# EAGLE design emp3032a (EAGLE 7.7.0)

## Sheet 1 of 2
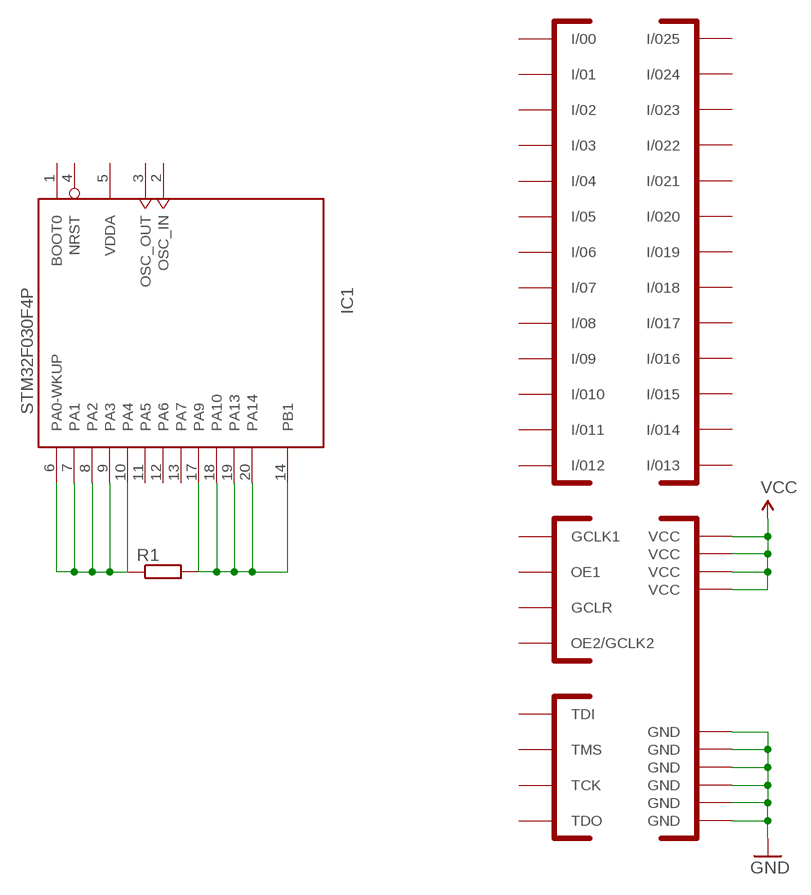
[diagram p0: schematic, sheet 1]

### Parts
IC1  STM32F030F4P  [TSSOP20-I]
R1  R1206  [R1206]
U$1  EPM3032  [TQFP44]

### Nets
GND: U$1.4(GND) U$1.11(GND) U$1.16(GND) U$1.24(GND) U$1.30(GND) U$1.36(GND) ; also sheet 2
N$1: IC1.6(PA0-WKUP) IC1.7(PA1) IC1.8(PA2) IC1.9(PA3) IC1.10(PA4) R1.1
N$2: IC1.14(PB1) IC1.17(PA9) IC1.18(PA10) IC1.19(PA13) IC1.20(PA14) R1.2
VCC: U$1.9(VCC) U$1.17(VCC) U$1.29(VCC) U$1.41(VCC)
Unconnected: IC1.1(BOOT0) IC1.2(OSC_IN) IC1.3(OSC_OUT) IC1.4(NRST) IC1.11(PA5) IC1.12(PA6) IC1.13(PA7)

## Sheet 2 of 2
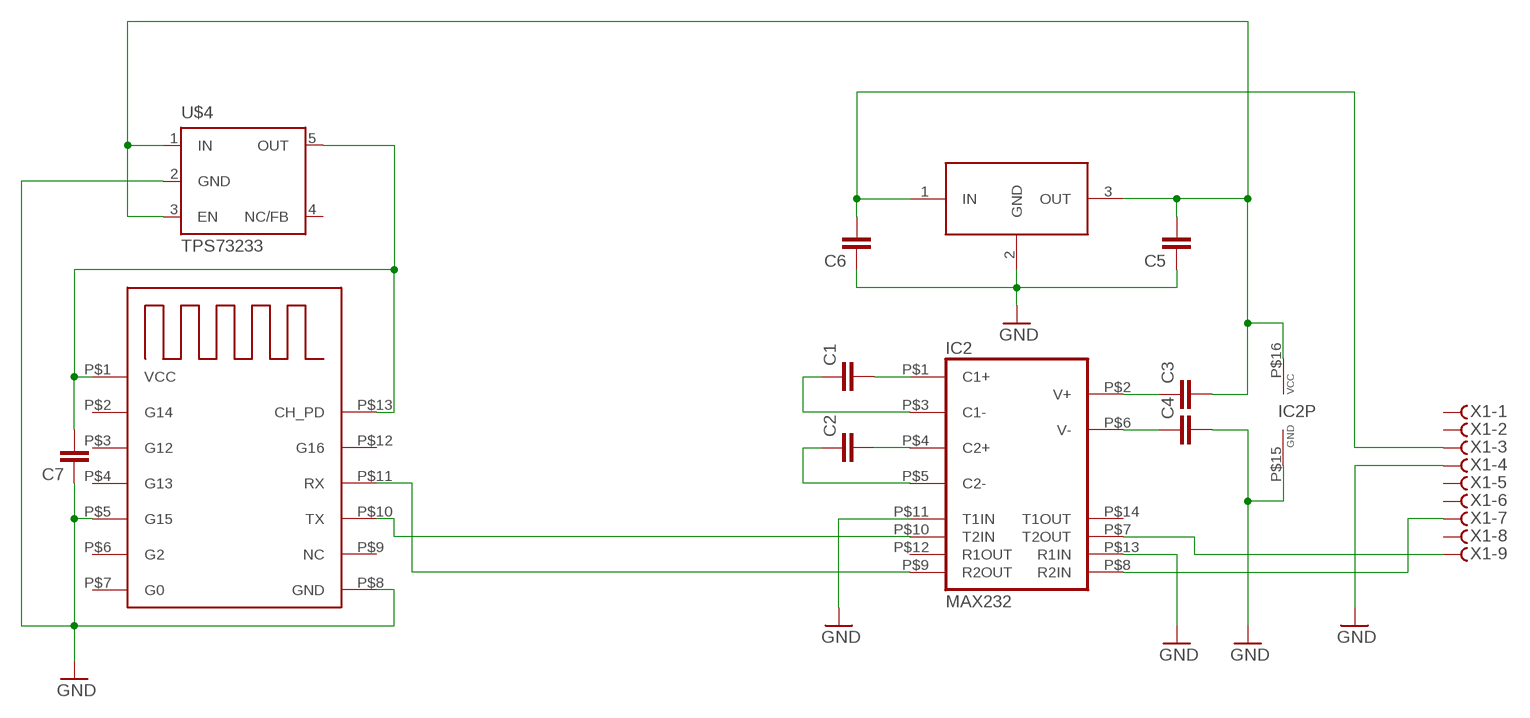
[diagram p1: schematic, sheet 2]

### Parts
C1  C-EUC1206K  [C1206K]
C2  C-EUC1206K  [C1206K]
C3  C-EUC1206K  [C1206K]
C4  C-EUC1206K  [C1206K]
C5  C-EUC1206K  [C1206K]
C6  C-EUC1206K  [C1206K]
C7  C-EUC1206K  [C1206K]
IC2  MAX232  [DIL16]
U$2  ESP03  [ESP03]
U$3  LM78M05BG  [DPACK]
U$4  TPS73233  [SOT23-DBV]
X1  F09HS  [F09H]

### Nets
GND: C4.2 C5.1 C6.1 C7.1 IC2.P$11(T1IN) IC2.P$13(R1IN) IC2.P$15(GND) U$2.P$5(G15) U$2.P$8(GND) U$3.2(GND) U$4.2(GND) X1.4 ; also sheet 1
N$3: C2.2 IC2.P$4(C2+)
N$4: C2.1 IC2.P$5(C2-)
N$5: C1.2 IC2.P$1(C1+)
N$6: C1.1 IC2.P$3(C1-)
N$7: C3.1 IC2.P$2(V+)
N$8: C4.1 IC2.P$6(V-)
N$9: IC2.P$9(R2OUT) U$2.P$11(RX)
N$10: IC2.P$7(T2OUT) X1.9
N$11: IC2.P$8(R2IN) X1.7
N$12: C6.2 U$3.1(IN) X1.3
N$13: IC2.P$10(T2IN) U$2.P$10(TX)
N$14: C7.2 U$2.P$1(VCC) U$2.P$13(CH_PD) U$4.5(OUT)
N$15: C3.2 C5.2 IC2.P$16(VCC) U$3.3(OUT) U$4.1(IN) U$4.3(EN)
Unconnected: IC2.P$12(R1OUT) IC2.P$14(T1OUT) U$2.P$2(G14) U$2.P$3(G12) U$2.P$4(G13) U$2.P$6(G2) U$2.P$7(G0) U$2.P$9(NC) U$2.P$12(G16) U$4.4(NC/FB) X1.1 X1.2 X1.5 X1.6 X1.8

## Power pins joined to a net without a drawn wire
GCLK1: U$1.37(GCLK1)
GCLR: U$1.39(GCLR)
I/00: U$1.2(I/00)
I/01: U$1.5(I/01)
I/02: U$1.6(I/02)
I/03: U$1.12(I/03)
I/04: U$1.13(I/04)
I/05: U$1.14(I/05)
I/06: U$1.15(I/06)
I/07: U$1.25(I/07)
I/08: U$1.44(I/08)
I/09: U$1.43(I/09)
I/010: U$1.42(I/010)
I/011: U$1.35(I/011)
I/012: U$1.34(I/012)
I/013: U$1.28(I/013)
I/014: U$1.27(I/014)
I/015: U$1.33(I/015)
I/016: U$1.21(I/016)
I/017: U$1.22(I/017)
I/018: U$1.23(I/018)
I/019: U$1.31(I/019)
I/020: U$1.18(I/020)
I/021: U$1.19(I/021)
I/022: U$1.8(I/022)
I/023: U$1.20(I/023)
I/024: U$1.10(I/024)
I/025: U$1.3(I/025)
OE1: U$1.38(OE1)
OE2/GCLK2: U$1.40(OE2/GCLK2)
TCK: U$1.26(TCK)
TDI: U$1.1(TDI)
TDO: U$1.32(TDO)
TMS: U$1.7(TMS)
VDD: IC1.16(VDD)
VDDA: IC1.5(VDDA)
VSS: IC1.15(VSS)

## Library data of the parts
C1-C7 = rcl:C-EU: CAPACITOR, European symbol
IC1 = micro-stm_v3:STM32F030F*P: ARM 32-bit Cortex™-M0 CPU 48 MHz maximum frequency 16 Kbytes of Flash memory 4 kbytes of SRAM 15 GPIOs 2.4 to 3.6 V application supply
IC2 = connectors:MAX232: RS232 TRANSEIVER
R1 = smalsmd:R
U$1 = EPM3032:EPM3032
U$2 = connectors:ESP03
U$3 = stabil:LM78M05BG
U$4 = stabil:TPS73233
X1 = con-subd:F09?S: SUB-D

## Board
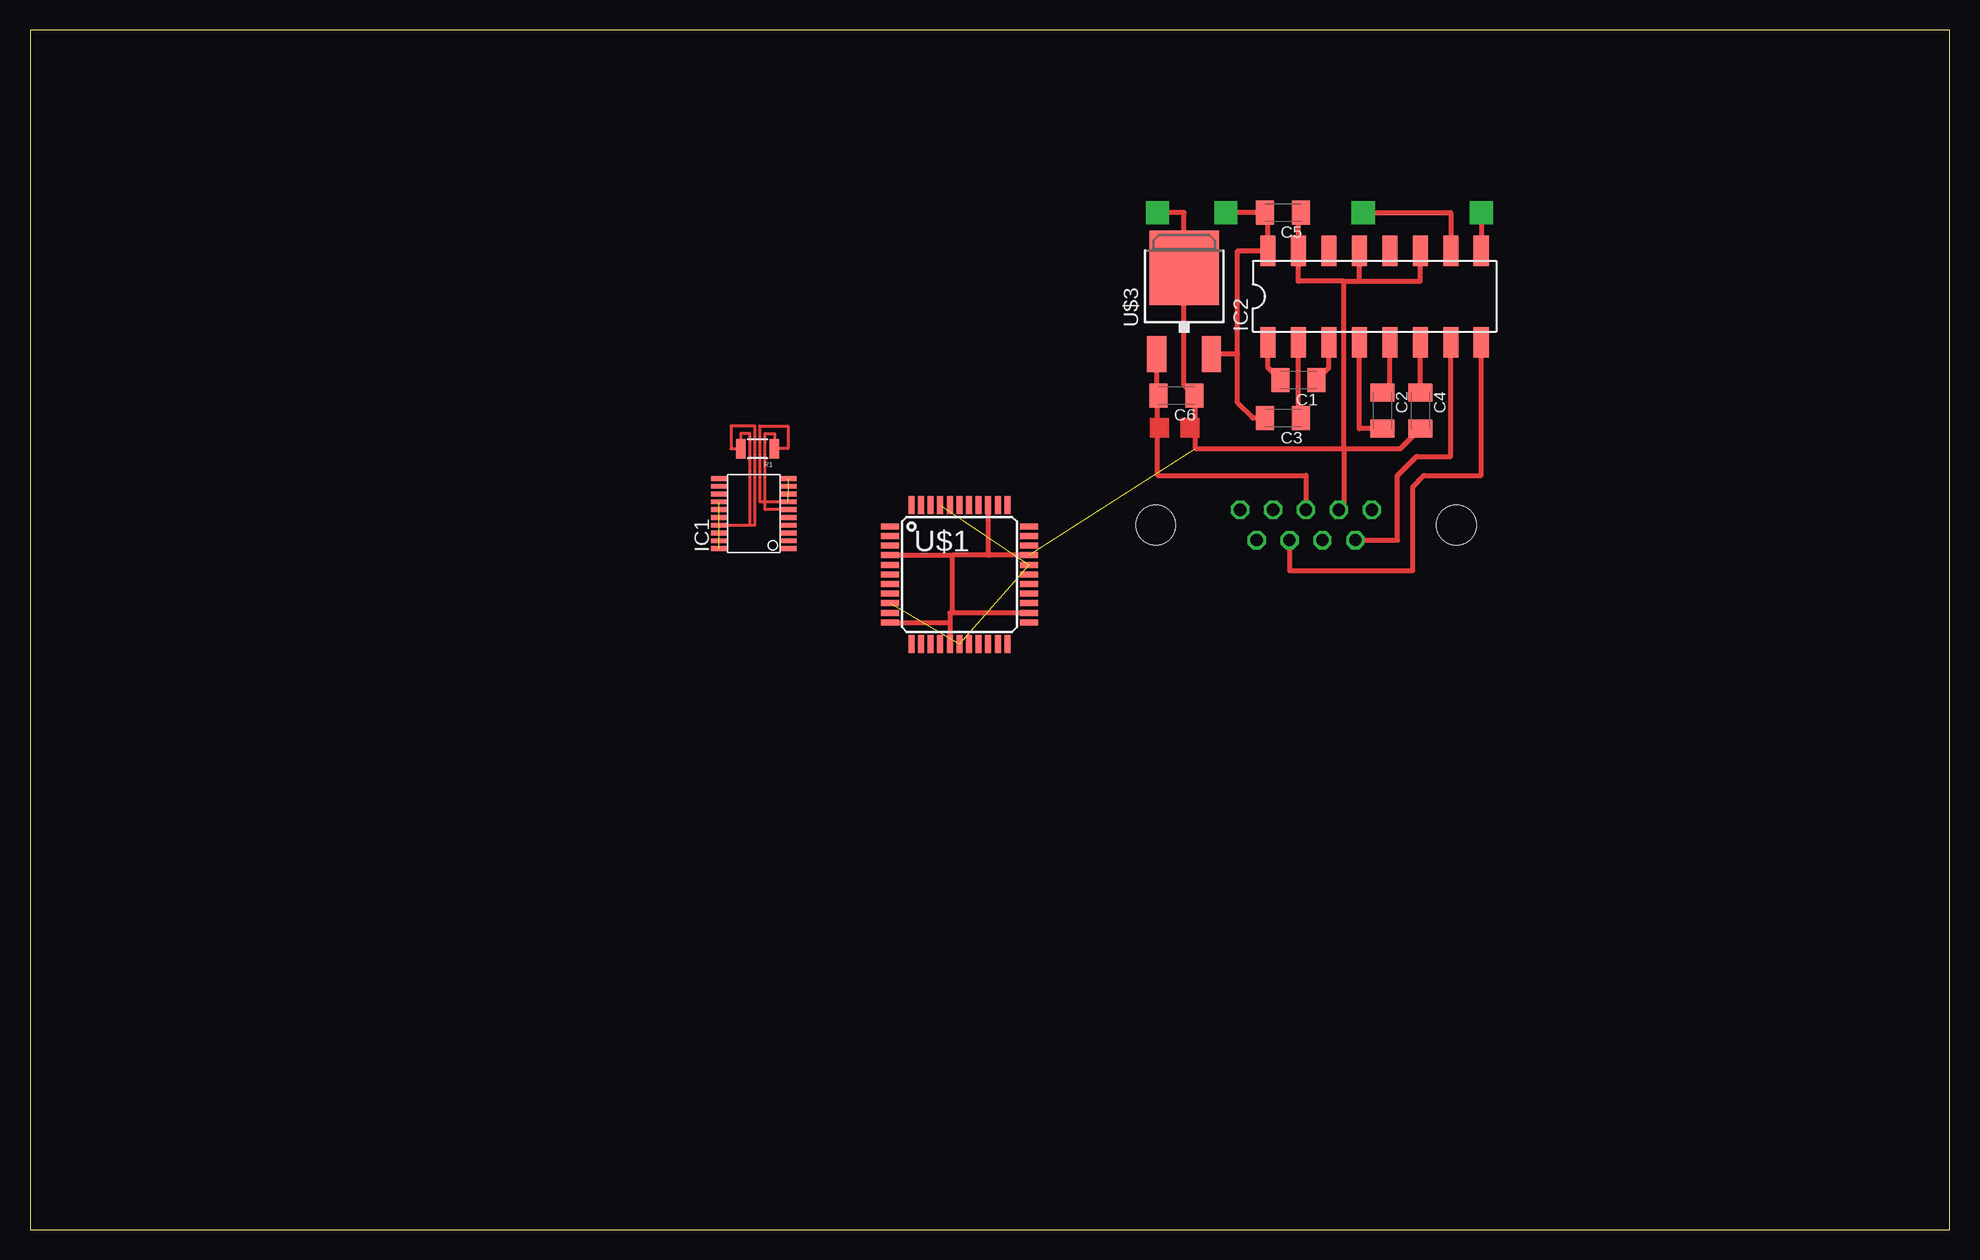
[diagram p2: board, top side]
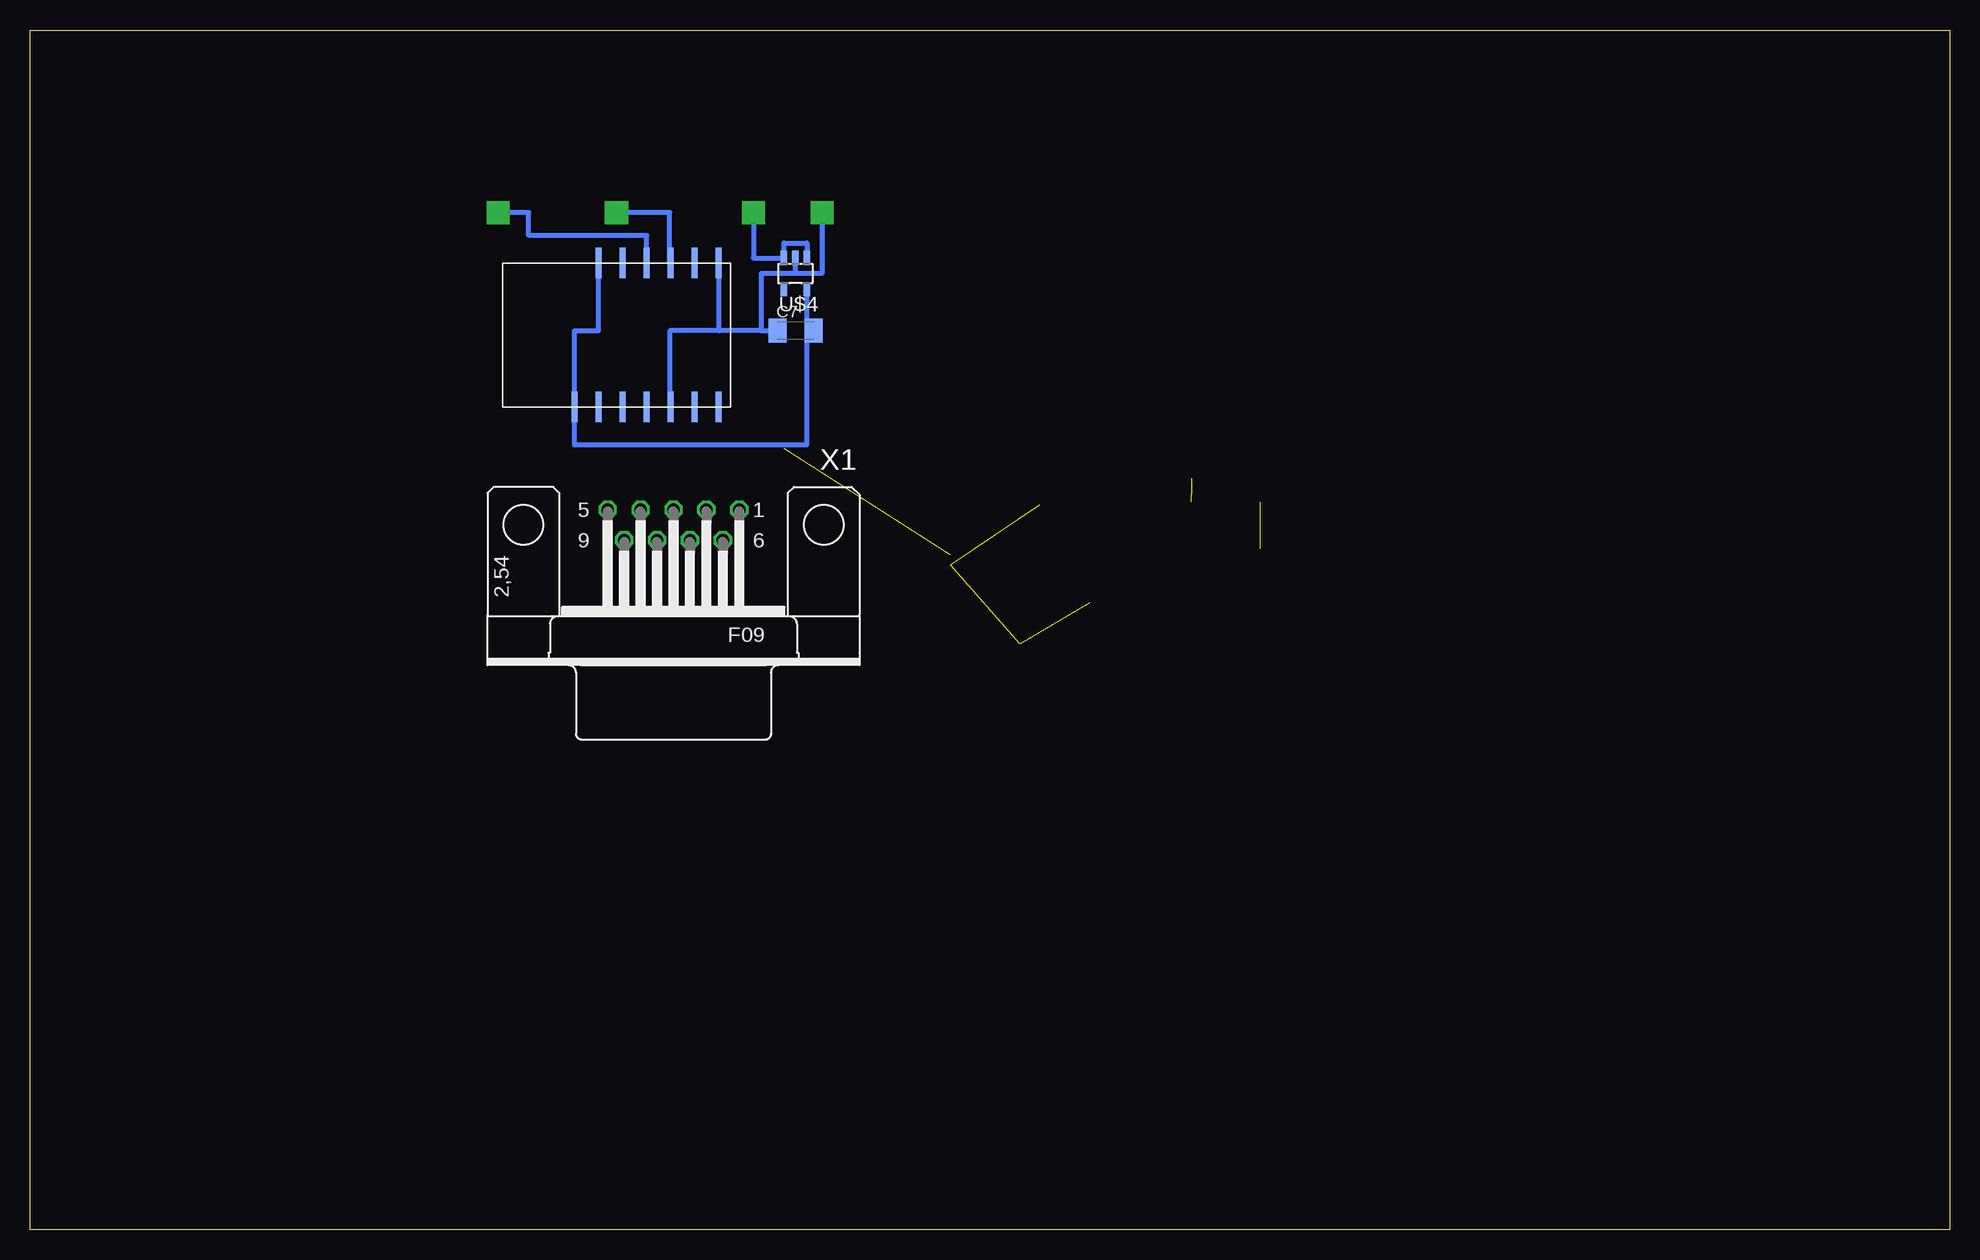
[diagram p3: board, bottom side, seen from below]

Size 160 x 100 mm. Coordinates in mm from the lower left corner, seen from the top.
Outline: 0,0 160,0 160,100 0,100 0,0
Copper layers (1*16): Top 0.035mm / dielectric 1.5mm / Bottom 0.035mm
Design rules "default": minimum track width 10mil, minimum drill 24mil, track to track 8mil, track to pad 8mil, pad to pad 8mil, via to via 8mil, smd to smd 8mil, copper to edge 40mil, drill to drill 8mil, minimum pad ring 10mil, minimum via ring 8mil, stop-mask expansion 4mil, vias tented up to drill 0mil, thermal gap 10mil

### Footprints (pad centres in the part's own frame; a part is rotated, then mirrored left to right if it is on the bottom)
C1206K = smd 1.5 x 2: 1 -1.5,0; 2 1.5,0
TSSOP20-I = smd 0.4 x 1.35: 1 -2.925,-2.875; 2 -2.275,-2.875; 3 -1.625,-2.875; 4 -0.975,-2.875; 5 -0.325,-2.875; 6 0.325,-2.875; 7 0.975,-2.875; 8 1.625,-2.875; 9 2.275,-2.875; 10 2.925,-2.875; 11 2.925,2.875; 12 2.275,2.875; 13 1.625,2.875; 14 0.975,2.875; 15 0.325,2.875; 16 -0.325,2.875; 17 -0.975,2.875; 18 -1.625,2.875; 19 -2.275,2.875; 20 -2.925,2.875
DIL16 = smd 1.27 x 2.54: P$1 -8.89,-3.81; P$2 -6.35,-3.81; P$3 -3.81,-3.81; P$4 -1.27,-3.81; P$5 1.27,-3.81; P$6 3.81,-3.81; P$7 6.35,-3.81; P$8 8.89,-3.81; P$9 8.89,3.81; P$10 6.35,3.81; P$11 3.81,3.81; P$12 1.27,3.81; P$13 -1.27,3.81; P$14 -3.81,3.81; P$15 -6.35,3.81; P$16 -8.89,3.81
R1206 = smd 0.8 x 1.6: 1 -1.4,0; 2 1.4,0
TQFP44 = smd 1.5 x 0.5: 1 -5.8,4; 2 -5.8,3.2; 3 -5.8,2.4; 4 -5.8,1.6; 5 -5.8,0.8; 6 -5.8,0; 7 -5.8,-0.8; 8 -5.8,-1.6; 9 -5.8,-2.4; 10 -5.8,-3.2; 11 -5.8,-4; 23 5.8,-4; 24 5.8,-3.2; 25 5.8,-2.4; 26 5.8,-1.6; 27 5.8,-0.8; 28 5.8,0; 29 5.8,0.8; 30 5.8,1.6; 31 5.8,2.4; 32 5.8,3.2; 33 5.8,4 | smd 0.5 x 1.5: 12 -4,-5.8; 13 -3.2,-5.8; 14 -2.4,-5.8; 15 -1.6,-5.8; 16 -0.8,-5.8; 17 0,-5.8; 18 0.8,-5.8; 19 1.6,-5.8; 20 2.4,-5.8; 21 3.2,-5.8; 22 4,-5.8; 34 4,5.8; 35 3.2,5.8; 36 2.4,5.8; 37 1.6,5.8; 38 0.8,5.8; 39 0,5.8; 40 -0.8,5.8; 41 -1.6,5.8; 42 -2.4,5.8; 43 -3.2,5.8; 44 -4,5.8
ESP03 = smd 2.54 x 0.5: P$1 0,0; P$2 0,-2; P$3 0,-4; P$4 0,-6; P$5 0,-8; P$6 0,-10; P$7 0,-12; P$8 12,-12; P$9 12,-10; P$10 12,-8; P$11 12,-6; P$12 12,-4; P$13 12,-2
DPACK = smd 1.6 x 3: 1 -2.28,-4.8; 3 2.28,-4.8 | smd 5.8 x 6.2: 2 0,2.38
SOT23-DBV = smd 0.55 x 1.2: 1 -0.95,-1.3; 2 0,-1.3; 3 0.95,-1.3; 4 0.95,1.3; 5 -0.95,1.3
F09H = drill 1.016 octagon: 1 -5.486,-1.27; 2 -2.743,-1.27; 3 0,-1.27; 4 2.743,-1.27; 5 5.486,-1.27; 6 -4.115,1.27; 7 -1.372,1.27; 8 1.372,1.27; 9 4.115,1.27 | hole 3.302: -12.522,0; 12.522,0

### Placement (x,y rotation side)
C1  105.73,70.8 180 top
C2  112.71,68.26 270 top
C3  104.46,67.63 180 top
C4  115.89,68.26 270 top
C5  104.46,84.77 180 top
C6  95.57,69.53 180 top
C7  96.2,74.93 0 bottom
IC1  60.33,59.69 90 top
IC2  112.08,77.79 0 top
R1  60.64,65.09 180 top
U$1  77.47,54.61 0 top
U$2  114.62,68.58 90 bottom
U$3  96.2,77.79 0 top
U$4  96.2,79.69 180 bottom
X1  106.36,58.74 180 bottom

### Tracks (layer width: path | path; a pad name or v marks a point on that pad's centre or on a via)
GND  (via drill 0 pad 1.93)  (1 unrouted)
  Top 0.406: U$1.11 76.67,50.61 | 76.67,50.61 U$1.16 | U$1.24 76.83,51.41 | 76.83,51.41 76.67,51.41 76.67,50.61 | U$1.30 80.01,56.21 79.87,56.21 | 79.87,56.21 76.83,56.21 | 76.83,56.21 76.83,51.41 | U$1.4 76.83,56.21 | U$1.36 79.87,56.21 | 115.89,66.99 C4.2 114.21,65.09 109.54,65.09 | 110.81,79.06 IC2.P$13 | 110.81,79.06 115.89,79.06 IC2.P$11 | 109.54,79.06 105.73,79.06 IC2.P$15 105.73,84.77 C5.1 | 109.54,79.06 110.81,79.06 | U$3.2 96.84,80.17 | U$3.2 96.2,70.4 C6.1 97.16,69.44 97.16,65.09 109.54,65.09 | X1.4 109.54,60.01 109.54,65.09 | 109.54,65.09 109.54,79.06 | v93.98,84.77 96.2,84.77 U$3.2
  Bottom 0.406: 96.2,79.69 99.06,79.69 99.06,74.93 | 96.2,79.69 U$4.2 | 99.06,74.93 C7.1 | U$2.P$5 106.68,68.58 106.68,74.93 102.55,74.93 | U$2.P$8 102.55,80.58 102.55,74.93 | 96.2,79.69 93.98,79.69 v93.98,84.77 | 99.06,74.93 102.55,74.93
N$1  (3 unrouted)
  Top 0.254: IC1.6 61.28,60.02 61.28,66.36 62.04,66.36 R1.1 63.18,65.09 63.18,66.99 60.84,66.99 60.84,60.66 IC1.7
N$2  (4 unrouted)
  Top 0.254: R1.2 59.24,66.36 60.01,66.36 60.01,58.72 IC1.17 60.42,58.72 60.42,66.99 58.42,66.99 58.42,65.09 59.37,65.09
N$3
  Top 0.406: 110.58,73.98 IC2.P$4 110.81,66.76 C2.2
N$4
  Top 0.406: C2.1 113.35,69.76 IC2.P$5
N$5
  Top 0.406: IC2.P$1 103.19,71.84 C1.2
N$6
  Top 0.406: IC2.P$3 108.27,71.84 C1.1
N$7
  Top 0.406: IC2.P$2 105.73,67.22 C3.1
N$8
  Top 0.406: C4.1 IC2.P$6
N$9  (via drill 0 pad 1.93)
  Top 0.406: v120.97,84.77 IC2.P$9
  Bottom 0.406: U$2.P$11 108.58,80.58 108.58,82.87 118.43,82.87 118.43,84.77 v120.97,84.77
N$10
  Top 0.406: X1.9 113.98,57.47 113.98,62.87 115.57,64.45 118.43,64.45 IC2.P$7
N$11
  Top 0.406: X1.7 104.99,54.93 115.25,54.93 115.25,61.91 116.2,62.87 120.97,62.87 IC2.P$8
N$12
  Top 0.406: U$3.1 93.92,69.53 C6.2 93.98,68.58 93.98,62.87 106.36,62.87 X1.3
N$13  (via drill 0 pad 1.93)
  Top 0.406: v111.12,84.77 118.43,84.77 IC2.P$10
  Bottom 0.406: U$2.P$10 106.68,80.58 106.68,84.77 v111.12,84.77
N$14
  Bottom 0.406: C7.2 95.25,74.93 U$4.5 95.25,65.41 114.62,65.41 U$2.P$1 114.62,74.93 112.62,74.93 U$2.P$13
N$15  (via drill 0 pad 1.93)
  Top 0.406: 100.65,72.99 U$3.3 | 100.65,72.99 100.65,81.6 IC2.P$16 103.19,84.77 C5.2 v99.69,84.77 | 100.65,72.99 100.65,68.9 101.92,67.63 C3.2
  Bottom 0.406: U$4.1 95.25,82.23 97.15,82.23 U$4.3 99.69,80.99 v99.69,84.77
VCC  (3 unrouted)
(copper drawn outside any net)
  shapes: Top area x2